# EAGLE design programmer shield with xtal (EAGLE 7.3.0)
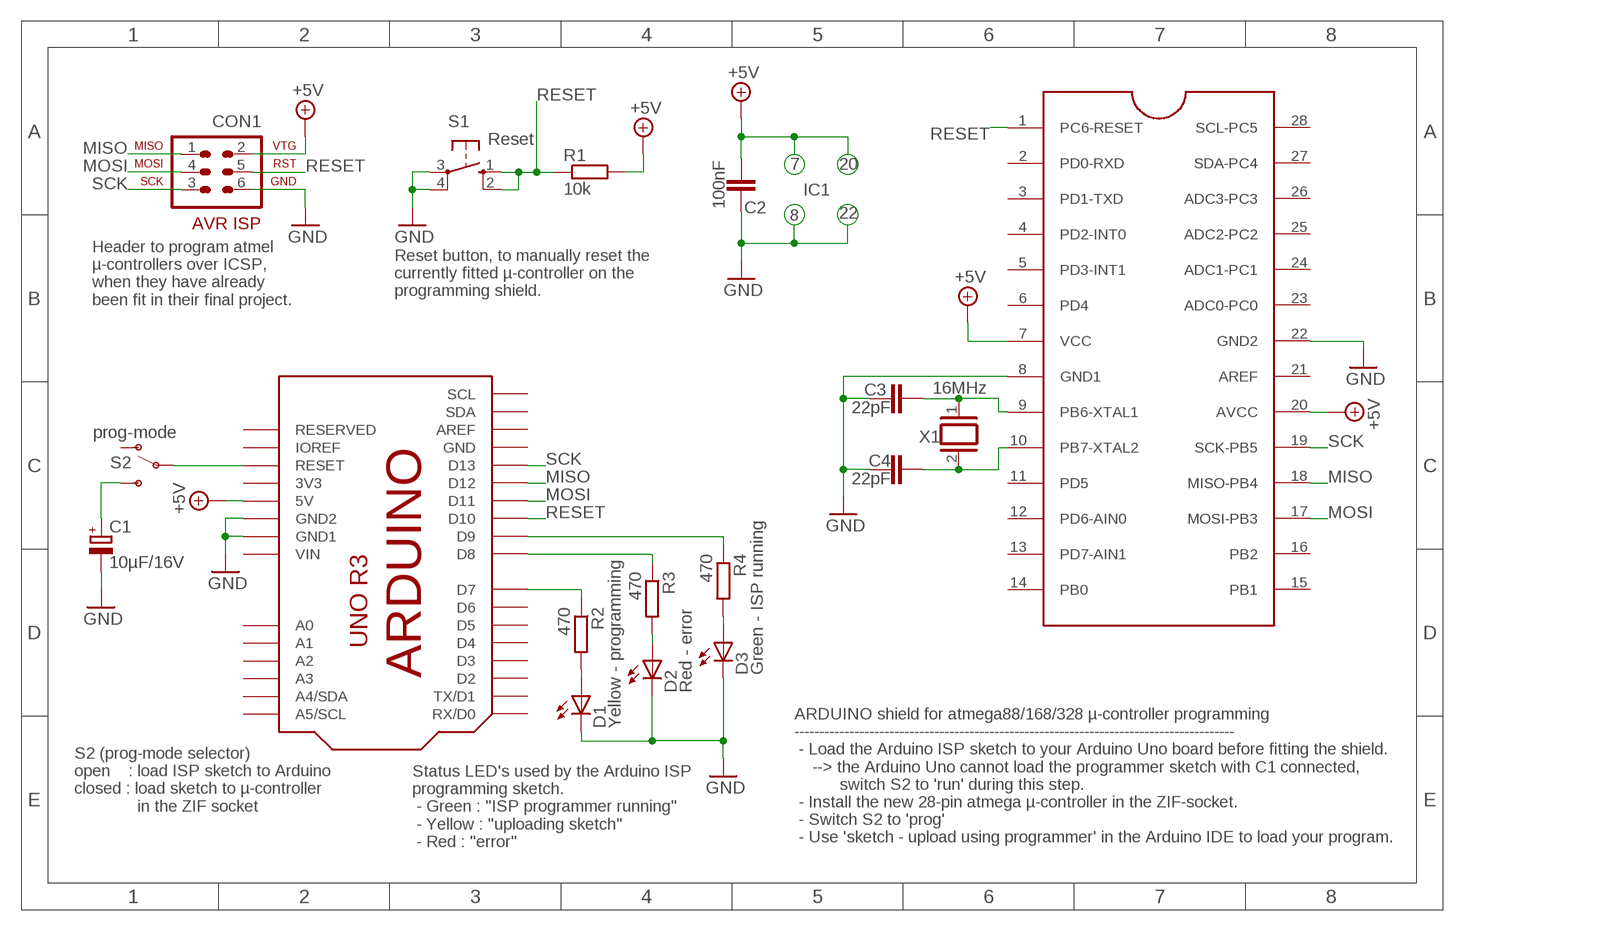
[diagram p0: schematic, sheet 1]

## Parts
C1  10µF/16V  CPOL-EUE2,5-6E  [E2,5-6E]
C2  100nF  C-EU050-025X075  [C050-025X075]
C3  22pF  C2.5/2  [C2.5-2]
C4  22pF  C2.5/2  [C2.5-2]
CON1  ICSP  AVR-ISP-6  [AVR-ISP-6]
D1  Yellow - programming  LED3MM  [LED3MM]
D2  Red - error  LED3MM  [LED3MM]
D3  Green - ISP running  LED3MM  [LED3MM]
IC1  Atmega88/168/328  ZIFSOCKET-28-3"  [DIL28-3-ZIF_NARROW]
R1  10k  R-EU_0207/7  [0207/7]
R2  470  R-EU_0204/5  [0204/5]
R3  470  R-EU_0204/5  [0204/5]
R4  470  R-EU_0204/5  [0204/5]
S1  Reset  10-XX  [B3F-10XX]
S2  prog-mode  SWITCH-SPDT_9.0X4.0MM  [MINI_SPDT_SWITCH-9.0X4.0MM]
U$1  Arduino Uno  ARDUINO-UNO_R3  [ARDUINO-R3]
X1  16MHz  XTAL/S  [QS]

## Nets
+UB: C2.2 CON1.2 IC1.7(VCC) IC1.20(AVCC) R1.2 U$1.5V ; supply symbol labelled +5V
GND: C1.- C2.1 C3.1 C4.1 CON1.6 D1.K(C) D2.K(C) D3.K(C) IC1.8(GND1) IC1.22(GND2) S1.3(P) S1.4(P1) U$1.GND1 U$1.GND2
MISO: CON1.1 IC1.18(MISO-PB4) U$1.D12
MOSI: CON1.4 IC1.17(MOSI-PB3) U$1.D11
N$1: C1.+ S2.3(S)
N$2: R4.1 U$1.D9
N$3: R2.1 U$1.D7
N$4: R3.1 U$1.D8
N$5: D1.A R2.2
N$6: D2.A R3.2
N$7: D3.A R4.2
N$8: C3.2 IC1.9(PB6-XTAL1) X1.1
N$9: C4.2 IC1.10(PB7-XTAL2) X1.2
N$19: S2.2(P) U$1.RESET
RESET: CON1.5 IC1.1(PC6-RESET) R1.1 S1.1(S) S1.2(S1) U$1.D10
SCK: CON1.3 IC1.19(SCK-PB5) U$1.D13
Unconnected: IC1.2(PD0-RXD) IC1.3(PD1-TXD) IC1.4(PD2-INT0) IC1.5(PD3-INT1) IC1.6(PD4) IC1.11(PD5) IC1.12(PD6-AIN0) IC1.13(PD7-AIN1) IC1.14(PB0) IC1.15(PB1) IC1.16(PB2) IC1.21(AREF) IC1.23(ADC0-PC0) IC1.24(ADC1-PC1) IC1.25(ADC2-PC2) IC1.26(ADC3-PC3) IC1.27(SDA-PC4) IC1.28(SCL-PC5) S2.1(O) U$1.A0 U$1.A1 U$1.A2 U$1.A3 U$1.A4(A4/SDA) U$1.A5(A5/SCL) U$1.AREF U$1.D0(RX/D0) U$1.D1(TX/D1) U$1.D2 U$1.D3 U$1.D4 U$1.D5 U$1.D6 U$1.IOREF U$1.RESERVED U$1.SCL U$1.SDA

## Notes on the sheet
- 7 | 20
- IC1
- 8 | 22
- Reset button, to manually reset the
  currently fitted µ-controller on the
  programming shield.
- Header to program atmel 
  µ-controllers over ICSP,
  when they have already
  been fit in their final project.
- S2 (prog-mode selector)
  open    : load ISP sketch to Arduino
  closed : load sketch to µ-controller 
                in the ZIF socket
- ARDUINO shield for atmega88/168/328 µ-controller programming
  ----------------------------------------------------------------------------------------
   - Load the Arduino ISP sketch to your Arduino Uno board before fitting the shield.
      --> the Arduino Uno cannot load the programmer sketch with C1 connected,
            switch S2 to 'run' during this step.
   - Install the new 28-pin atmega µ-controller in the ZIF-socket.
   - Switch S2 to 'prog'
   - Use 'sketch - upload using programmer' in the Arduino IDE to load your program.
- Status LED's used by the Arduino ISP 
  programming sketch.
   - Green : "ISP programmer running"
   - Yellow : "uploading sketch"
   - Red : "error"

## Power pins joined to a net without a drawn wire
3V3: U$1.3V(3V3)
GND: U$1.GND
VIN: U$1.VIN

## Library data of the parts
C1 = rcl:CPOL-EU: POLARIZED CAPACITOR, European symbol
C2 = rcl:C-EU: CAPACITOR, European symbol
C3 C4 = capacitor-wima:C: CAPACITOR naming: grid - package width
CON1 = avr-4:AVR-ISP-6: AVR ISP-6 Serial Programming Header
D1-D3 = led:LED: LED OSRAM: - CHIPLED LG R971, LG N971, LY N971, LG Q971, LY Q971, LO R971, LY R971 LH N974, LH R974 LS Q976, LO Q976, LY Q976 LO Q996 - Hyper CHIPLED LW Q18S LB Q993, LB Q99A, LB R99A - SideLED LS A670, LO A670, LY A670, LG A670, LP A670 LB A673, LV A673, LT A673, LW A673 LH A674 LY A675 LS A676, LA A676, LO A676, LY A676, LW A676 LS A679, LY A679, LG A679 - Hyper Micro SIDELED® LS Y876, LA Y876, LO Y876, LY Y876 LT Y87S - SmartLED LW L88C, LW L88S LB L89C, LB L89S, LG L890 LS L89K, LO L89K, LY L89K LS L896, LA L896, LO L896, LY L896 - TOPLED LS T670, LO T670, LY T670, LG T670, LP T670 LSG T670, LSP T670, LSY T670, LOP T670, LYG T670 LG T671, LOG T671, LSG T671 LB T673, LV T673, LT T673, LW T673 LH T674 LS T676, LA T676, LO T676, LY T676, LB T676, LH T676, LSB T676, LW T676 LB T67C, LV T67C, LT T67C, LS T67K, LO T67K, LY T67K, LW E67C LS E67B, LA E67B, LO E67B, LY E67B, LB E67C, LV E67C, LT E67C LW T67C LS T679, LY T679, LG T679 LS T770, LO T770, LY T770, LG T770, LP T770 LB T773, LV T773, LT T773, LW T773 LH T774 LS E675, LA E675, LY E675, LS T675 LS T776, LA T776, LO T776, LY T776, LB T776 LHGB T686 LT T68C, LB T68C - Hyper Mini TOPLED® LB M676 - Mini TOPLED Santana® LG M470 LS M47K, LO M47K, LY M47K Source: http://www.osram.convergy.de LUXEON: - LUMILED® LXK2-PW12-R00, LXK2-PW12-S00, LXK2-PW14-U00, LXK2-PW14-V00 LXK2-PM12-R00, LXK2-PM12-S00, LXK2-PM14-U00 LXK2-PE12-Q00, LXK2-PE12-R00, LXK2-PE12-S00, LXK2-PE14-T00, LXK2-PE14-U00 LXK2-PB12-K00, LXK2-PB12-L00, LXK2-PB12-M00, LXK2-PB14-N00, LXK2-PB14-P00, LXK2-PB14-Q00 LXK2-PR12-L00, LXK2-PR12-M00, LXK2-PR14-Q00, LXK2-PR14-R00 LXK2-PD12-Q00, LXK2-PD12-R00, LXK2-PD12-S00 LXK2-PH12-R00, LXK2-PH12-S00 LXK2-PL12-P00, LXK2-PL12-Q00, LXK2-PL12-R00 Source: www.luxeon.com KINGBRIGHT: KA-3528ASYC Source: www.kingbright.com
IC1 = ccr-lib:ZIFSOCKET-28-3: ZIF Socket 28-Pin 0.3" Lever-action ZIF socket for 28-pin ICs
R1-R4 = resistor:R-EU_: RESISTOR, European symbol
S1 = switch-omron:10-XX: OMRON SWITCH; MPN: B3F-1000; OC_FARNELL: 176432; OC_NEWARK: 36M3542
S2 = ccr-lib:SWITCH-SPDT: Single-Pole, Double-Throw (SPDT) mini Switch
U$1 = ccr-lib:ARDUINO-UNO: Arduino R3 with extra pins : - IOref pin - reserved pin - duplicated I2C, A4/A5 pins
X1 = special:XTAL/S: CRYSTAL

## Board
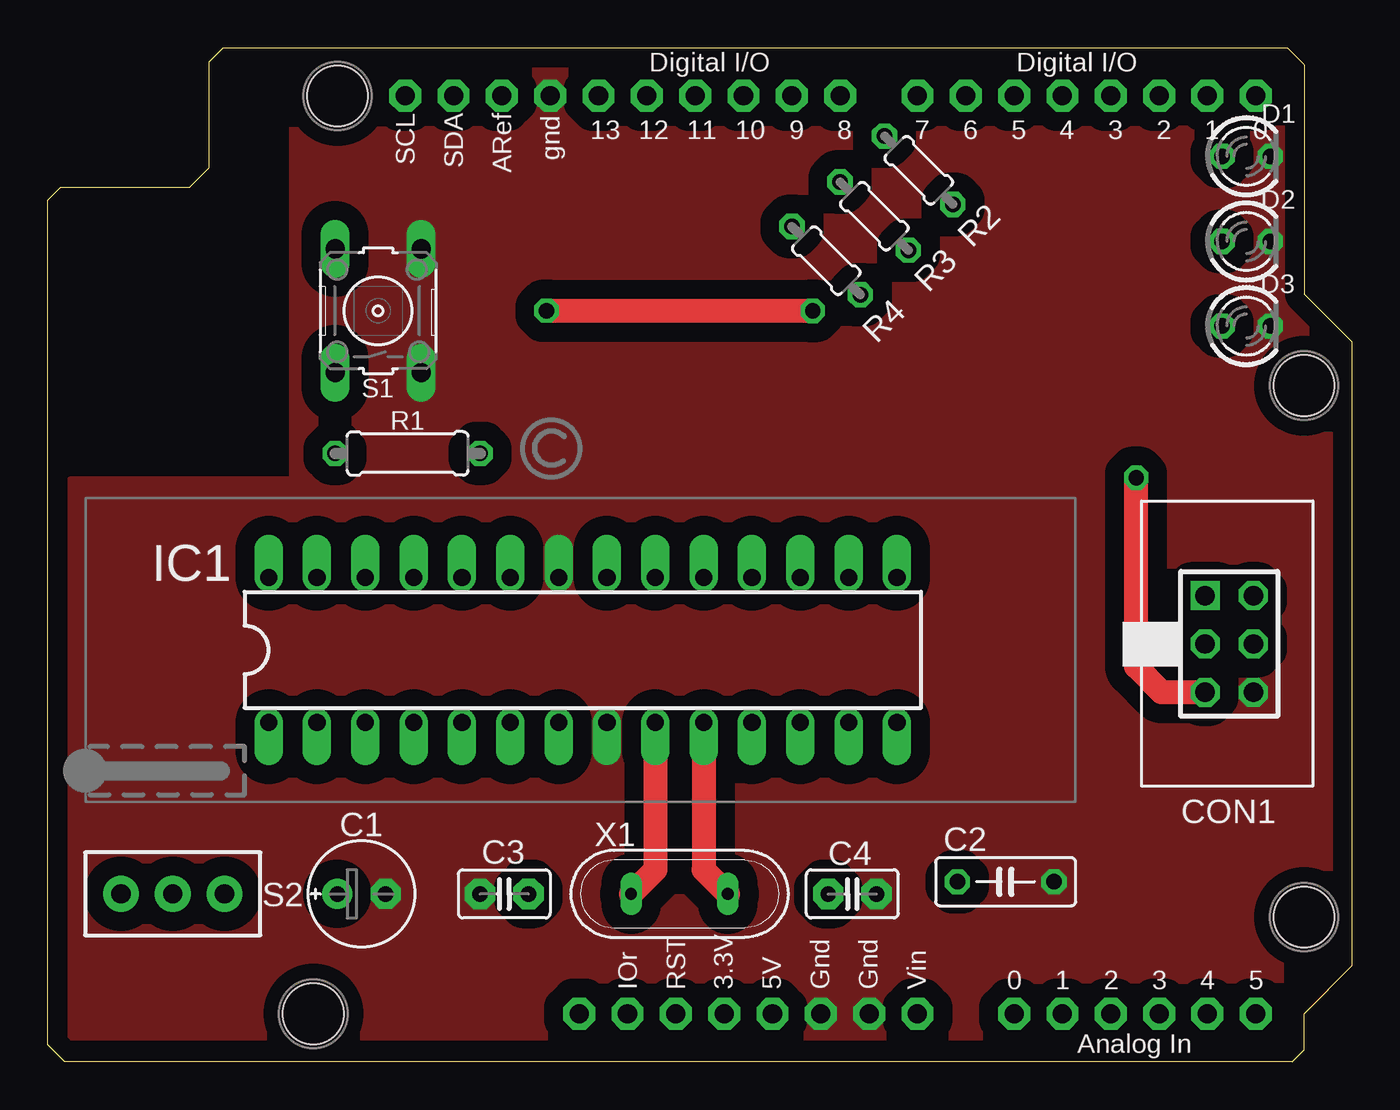
[diagram p1: board, top side]
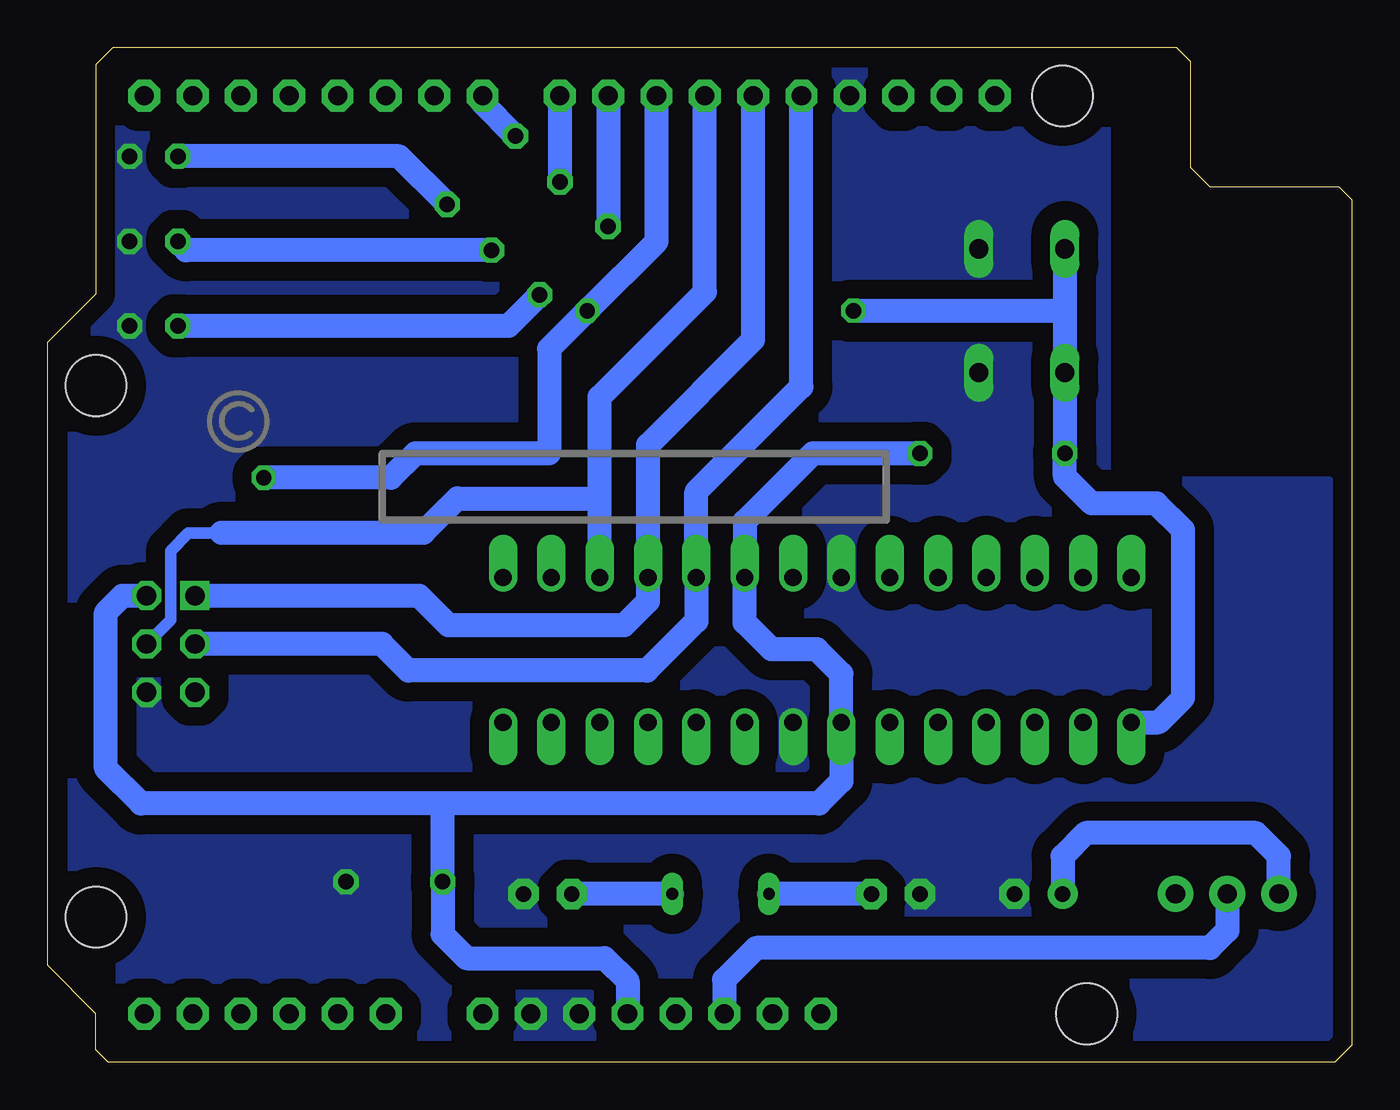
[diagram p2: board, bottom side, seen from below]

Size 68.58 x 53.34 mm. Coordinates in mm from the lower left corner, seen from the top.
Copper layers (1*16): Top 0.035mm / dielectric 1.5mm / Bottom 0.035mm
Design rules "ccc - AllPCB(prototyping)": minimum track width 16mil, minimum drill 0.4mm, track to track 6mil, track to pad 6mil, pad to pad 6mil, via to via 6mil, smd to smd 6mil, copper to edge 40mil, drill to drill 8mil, minimum pad ring 10mil, minimum via ring 8mil, stop-mask expansion 4mil, vias tented up to drill 0mil, thermal gap 10mil

### Footprints (pad centres in the part's own frame; a part is rotated, then mirrored left to right if it is on the bottom)
E2,5-6E = drill 0.813 pad 1.575: + -1.27,0 | drill 0.813 pad 1.575 octagon: - 1.27,0
C050-025X075 = drill 0.813 octagon: 1 -2.54,0; 2 2.54,0
C2.5-2 = drill 0.813 pad 1.6 octagon: 1 -1.27,0; 2 1.27,0
AVR-ISP-6 = drill 1.016 square: 1 -2.54,-1.27 | drill 1.016 octagon: 2 -2.54,1.27; 3 0,-1.27; 4 0,1.27; 5 2.54,-1.27; 6 2.54,1.27
LED3MM = drill 0.813 octagon: A -1.27,0; K 1.27,0
DIL28-3-ZIF_NARROW = drill 0.9 pad 1.5 offset: 1 -16.51,-3.81; 2 -13.97,-3.81; 3 -11.43,-3.81; 4 -8.89,-3.81; 5 -6.35,-3.81; 6 -3.81,-3.81; 7 -1.27,-3.81; 8 1.27,-3.81; 9 3.81,-3.81; 10 6.35,-3.81; 11 8.89,-3.81; 12 11.43,-3.81; 13 13.97,-3.81; 14 16.51,-3.81; 15 16.51,3.81; 16 13.97,3.81; 17 11.43,3.81; 18 8.89,3.81; 19 6.35,3.81; 20 3.81,3.81; 21 1.27,3.81; 22 -1.27,3.81; 23 -3.81,3.81; 24 -6.35,3.81; 25 -8.89,3.81; 26 -11.43,3.81; 27 -13.97,3.81; 28 -16.51,3.81
0207/7 = drill 0.813 octagon: 1 -3.81,0; 2 3.81,0
0204/5 = drill 0.813 octagon: 1 -2.54,0; 2 2.54,0
B3F-10XX = drill 1.016 long: 1 -3.251,2.261; 2 3.251,2.261; 3 -3.251,-2.261; 4 3.251,-2.261
MINI_SPDT_SWITCH-9.0X4.0MM = drill 1.016 pad 1.88: 1 2.718,0; 2 0,0; 3 -2.718,0
ARDUINO-R3 = drill 1 pad 1.676 octagon: 3V 35.56,2.54; 5V 38.1,2.54; A0 50.8,2.54; A1 53.34,2.54; A2 55.88,2.54; A3 58.42,2.54; A4 60.96,2.54; A5 63.5,2.54; AREF 23.876,50.8; D0 63.5,50.8; D1 60.96,50.8; D2 58.42,50.8; D3 55.88,50.8; D4 53.34,50.8; D5 50.8,50.8; D6 48.26,50.8; D7 45.72,50.8; D8 41.656,50.8; D9 39.116,50.8; D10 36.576,50.8; D11 34.036,50.8; D12 31.496,50.8; D13 28.956,50.8; GND 26.416,50.8; GND1 43.18,2.54; GND2 40.64,2.54; IOREF 30.48,2.54; RESERVED 27.94,2.54; RESET 33.02,2.54; SCL 18.796,50.8; SDA 21.336,50.8; VIN 45.72,2.54 | hole 3.2: 15.24,50.8; 66.04,7.62; 13.97,2.54; 66.04,35.56
QS = drill 0.61 long: 1 -2.54,0; 2 2.54,0

### Placement (x,y rotation side)
C1  16.5,8.84 0 top
C2  50.35,9.47 180 top
C3  24,8.84 0 top
C4  42.3,8.84 180 top
CON1  62.11,21.98 270 top
D1  63,47.62 0 top
D2  63,43.15 0 top
D3  63,38.7 0 top
IC1  28.13,21.67 0 top
R1  18.92,32 0 top
R2  45.78,46.89 315 top
R3  43.45,44.48 315 top
R4  40.92,42.14 315 top
S1  17.38,39.5 90 top
S2  6.58,8.84 0 top
U$1  0,0 0 top
U$2  [COPYRIGHT-LOGO-3-B]  58.56,33.68 0 top
U$3  [3X-LOGO-10-B]  0.13,34.95 0 top
U$4  [COPYRIGHT-LOGO-3-T]  26.47,32.25 0 top
U$5  [3X-LOGO-5-B]  45.67,19.15 0 top
U$6  [3X-LOGO-5-T]  47.07,19.15 0 top
U$7  [3X-LOGO-10-B]  12.9,34.94 0 bottom
X1  33.21,8.84 0 top

### Tracks (layer width: path | path; a pad name or v marks a point on that pad's centre or on a via)
+UB
  Bottom 1.27: R1.2 28.36,32 31.94,28.42 IC1.20 31.94,23.1 30.53,21.69 28.15,21.69 26.86,20.4 IC1.7 26.86,14.78 28.05,13.59 47.81,13.59 | 47.81,13.59 63.67,13.59 65.52,15.44 65.52,23.63 64.63,24.52 CON1.2 | U$1.5V 38.1,4.26 39.3,5.46 46.56,5.46 47.81,6.72 C2.2 47.81,13.59
GND
  pour Bottom (isolate 1, no thermals): 64.7,6 64.7,1.4 1.25,1.4 1.25,30.5 13,30.5 13,52 65.2,52 65.2,39.75 67.5,37.01 67.5,6
  pour Top (isolate 1, no thermals): 64.69,6.03 64.69,1.43 1.24,1.43 1.24,30.5 13,30.5 13,52 65.19,52 65.19,39.78 67.49,37.03 67.49,6.03
MISO
  Bottom 1.27: U$1.D12 31.5,37.97 37.02,32.45 IC1.18 37.02,24.23 38.28,22.97 47.51,22.97 49.06,24.52 CON1.1
MOSI
  Bottom 0.61: CON1.4 62.12,23.24 62.12,26.88 61.18,27.81 59.45,27.81 59.45,27.84
  Bottom 1.27: IC1.17 39.56,29.63 | 39.56,29.63 39.56,34.96 34.04,40.49 U$1.D11 | 59.45,27.84 48.83,27.84 47.04,29.63 39.56,29.63
N$1
  Bottom 1.27: S2.3 3.86,10.83 5.07,12.04 14,12.04 15.23,10.81 C1.+
N$2
  Bottom 1.27: U$1.D9 R4.1
N$3
  Bottom 1.27: R2.1 45.72,50.42 U$1.D7
N$4
  Bottom 1.27: U$1.D8 R3.1
N$5
  Bottom 1.27: R2.2 50.11,47.62 D1.A
N$6
  Bottom 1.27: R3.2 61.29,42.68 D2.A
N$7
  Bottom 1.27: R4.2 44.36,38.7 D3.A
N$8
  Top 1.27: IC1.9 31.94,10.11 X1.1
  Bottom 1.27: C3.2 X1.1
N$9
  Top 1.27: IC1.10 34.48,10.11 X1.2
  Bottom 1.27: X1.2 C4.2
N$19
  Bottom 1.27: S2.2 6.58,6.91 7.49,6 31.34,6 33.02,4.32 U$1.RESET
N$22  (via drill 1 pad 1.68)
  other vias: 21.34,50.8
N$23  (via drill 1 pad 1.68)
  other vias: 18.8,50.8
RESET  (via drill 0.8 pad 1.27)
  Top 1.27: CON1.5 58.56,19.44 57.21,20.79 v57.21,30.72 | v26.22,39.5 v40.22,39.5
  Bottom 1.27: IC1.1 10.19,17.86 8.9,19.14 8.9,27.97 10.3,29.38 13.7,29.38 15.11,30.78 R1.1 S1.1 15.12,39.5 | U$1.D10 36.58,43.14 40.18,39.54 v40.22,39.5 42.22,37.5 42.22,32 49.25,32 50.53,30.72 v57.21,30.72 | S1.2 15.12,39.5 | v26.22,39.5 15.12,39.5
SCK
  Bottom 1.27: U$1.D13 28.96,35.51 34.48,29.98 IC1.19 34.48,23.19 37.08,20.59 49.62,20.59 51.02,21.98 CON1.3

### Text on the board
tDocu: SCK | MISO | MOSI | RESET | uploading | RESET | Error! | ISP running | Designed by the / Nostradomus Engineering Team | Carl | 2017/008 V01 | In Circuit Serial Programmer | mode | PROG-RUN | Atmega88/168/328 / programmer shield
bDocu: Designed by the / Nostradomus Engineering Team | 2017/008 V01 | Carl | ser. | Atmega88/168/328 / programmer shield